# EAGLE design brobot19-MICRO (EAGLE 7.1.0)
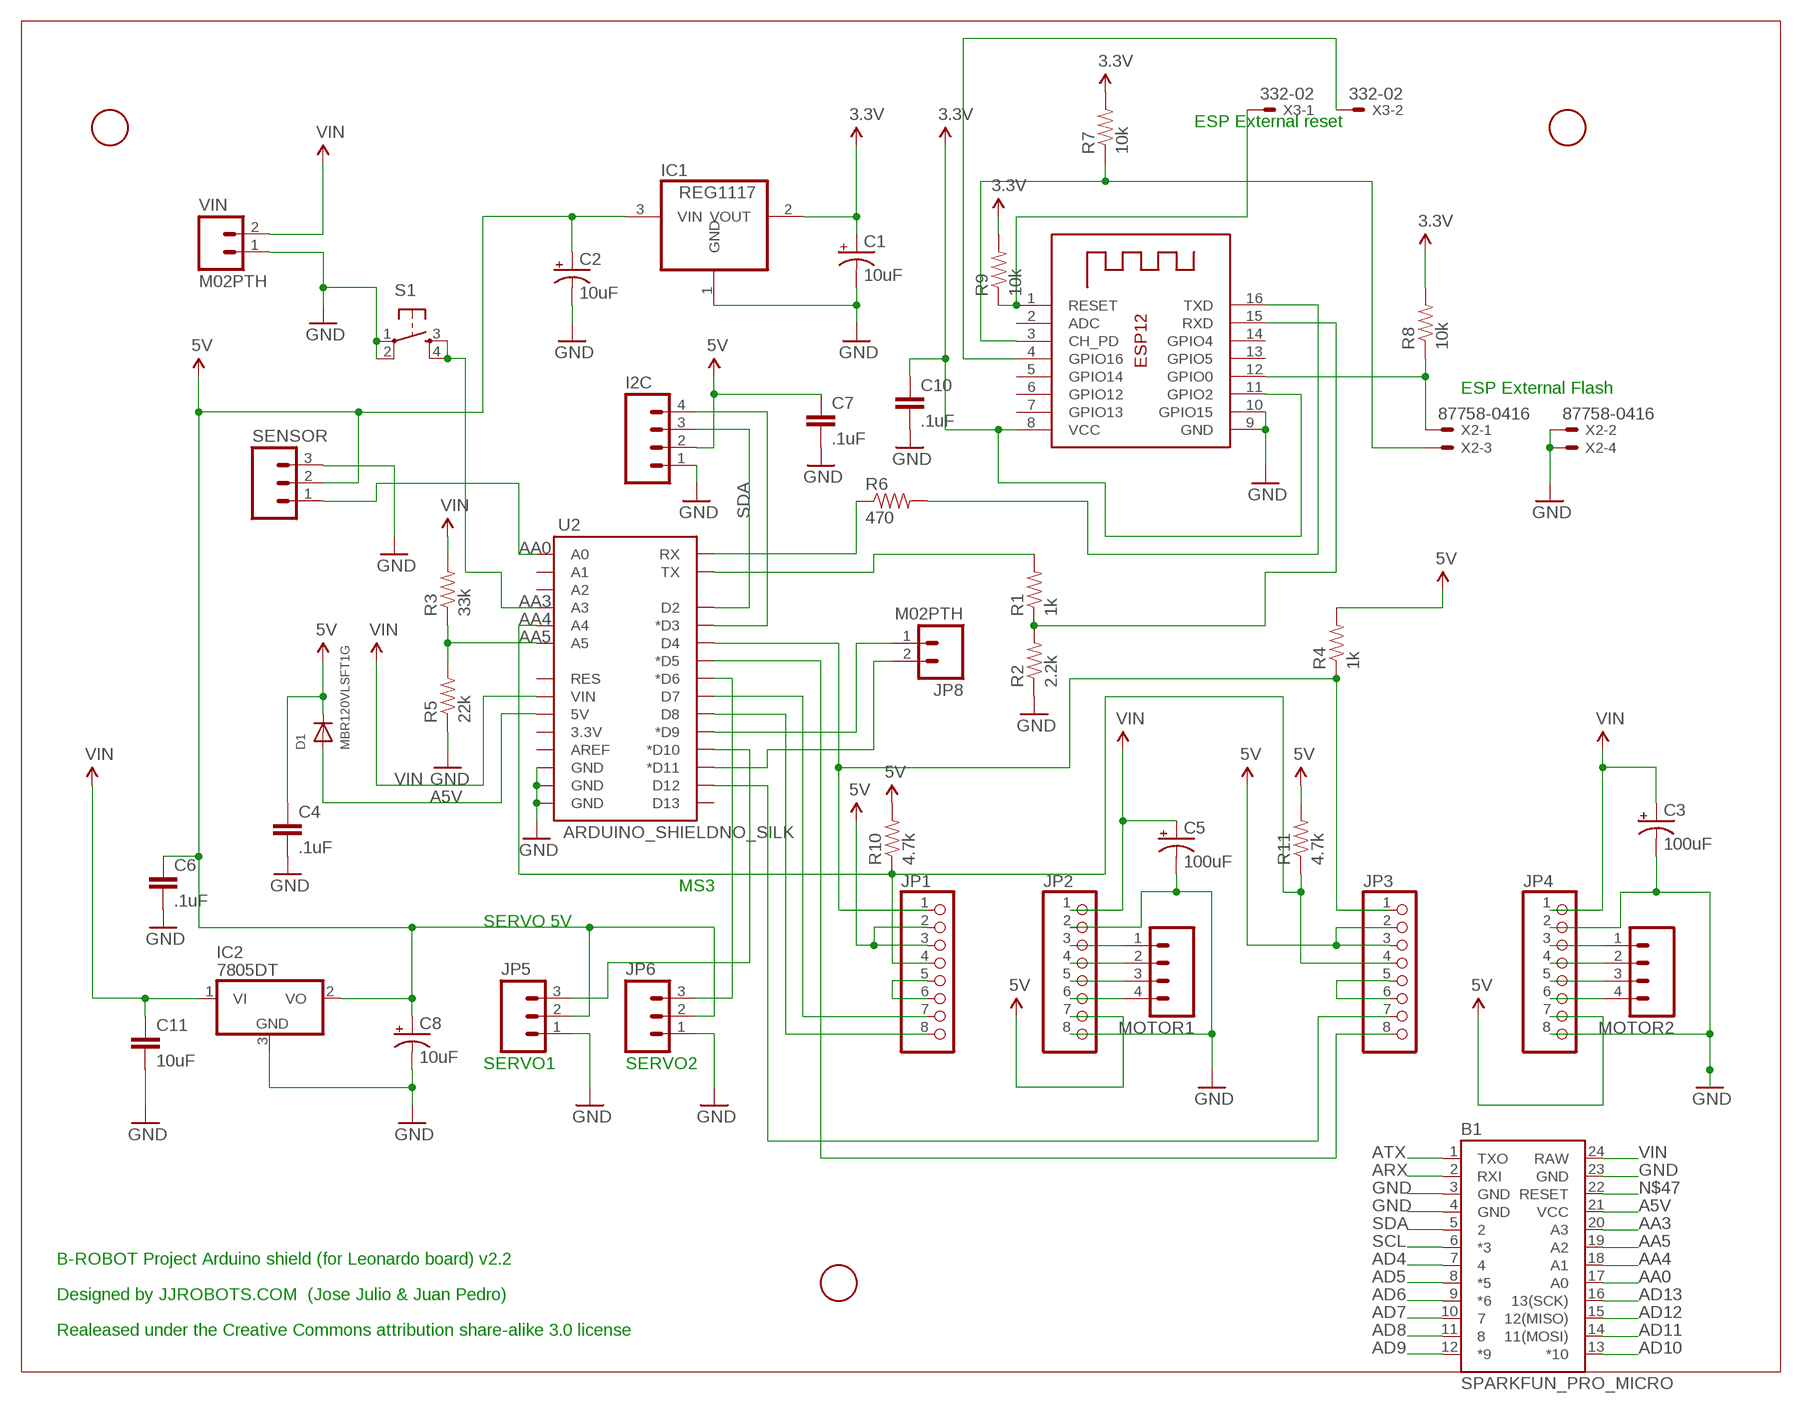
[diagram p0: schematic, sheet 1]

## Parts
B1  SPARKFUN_PRO_MICRO  [SPARKFUN_PRO_MICRO]
C1  10uF  CAP_POL1206  [EIA3216]
C2  10uF  CAP_POL1206  [EIA3216]
C3  100uF  CAP_POLD  [PANASONIC_D]
C4  .1uF  CAP0402-CAP  [0402-CAP]
C5  100uF  CAP_POLD  [PANASONIC_D]
C6  .1uF  CAP0402-CAP  [0402-CAP]
C7  .1uF  CAP0402-CAP  [0402-CAP]
C8  10uF  CAP_POL1206  [EIA3216]
C10  .1uF  CAP0402-CAP  [0402-CAP]
C11  10uF  CAP1206  [1206]
D1  MBR120VLSFT1G  DIODESOD-123  [SOD-123]
I2C  M04PTH  [1X04]
IC1  REG1117  [SOT223]
IC2  7805DT  [TO252]
JP1  PINHD-1X8  [1X08]
JP2  PINHD-1X8  [1X08]
JP3  PINHD-1X8  [1X08]
JP4  PINHD-1X8  [1X08]
JP5  M03PTH  [1X03]
JP6  M03PTH  [1X03]
JP8  M02PTH  [1X02]
MOTOR1  M04PTH  [1X04]
MOTOR2  M04PTH  [1X04]
R1  1k  RESISTOR0805-RES  [0805]
R2  2.2k  RESISTOR0805-RES  [0805]
R3  33k  RESISTOR0805-RES  [0805]
R4  1k  RESISTOR0805-RES  [0805]
R5  22k  RESISTOR0805-RES  [0805]
R6  470  RESISTOR0805-RES  [0805]
R7  10k  RESISTOR0805-RES  [0805]
R8  10k  RESISTOR0805-RES  [0805]
R9  10k  RESISTOR0805-RES  [0805]
R10  4.7k  RESISTOR0805-RES  [0805]
R11  4.7k  RESISTOR0805-RES  [0805]
S1  TAC_SWITCHSMD  [TACTILE-SWITCH-SMD]
SENSOR  M03PTH  [1X03]
U2  ARDUINO_SHIELDNO_SILK  [DUEMILANOVE_VIAS]
U$1  FIDUCIAL  [FIDUCIAL_1MM]
U$2  FIDUCIAL  [FIDUCIAL_1MM]
U$3  FIDUCIAL  [FIDUCIAL_1MM]
VIN  M02PTH  [1X02]
X1  ESP-12  [ESP-12]
X2  87758-0416  [87758-0416]
X3  332-02  [332-02]

## Nets
3.3V: C1.A(+) C10.1 IC1.2(VOUT) R7.2 R8.2 R9.2 X1.8(VCC) X1.11(GPIO2)
5V: C2.A(+) C4.1 C6.1 C7.1 C8.A(+) D1.C I2C.2 IC1.3(VIN) IC2.2(VO) JP1.2 JP1.3 JP2.7 JP3.2 JP3.3 JP4.7 JP5.2 JP6.2 R4.2 R10.2 R11.2 SENSOR.2
A5V: B1.21(VCC) D1.A U2.5V
AA0: B1.17(A0) SENSOR.1 U2.A0
AA3: B1.20(A3) S1.3 S1.4 U2.A3
AA4: B1.18(A1) JP1.4 JP3.4 R10.1 R11.1 U2.A4
AA5: B1.19(A2) R3.1 R5.2 U2.A5
AD4: B1.7 JP1.1 JP3.1 R4.1 U2.D4
AD5: B1.8(*5) JP3.8 U2.D5(*D5)
AD6: B1.9(*6) JP6.3 U2.D6(*D6)
AD7: B1.10 JP1.7 U2.D7
AD8: B1.11 JP1.8 U2.D8
AD9: B1.12(*9) JP8.1 U2.D9(*D9)
AD10: B1.13(*10) JP5.3 U2.D10(*D10)
AD11: B1.14(11(MOSI)) JP8.2 U2.D11(*D11)
AD12: B1.15(12(MISO)) JP3.7 U2.D12
AD13: B1.16(13(SCK))
ARX: B1.2(RXI) R6.1 U2.RX
ATX: B1.1(TXO) R1.2 U2.TX
GND: B1.3(GND) B1.4(GND) B1.23(GND) C1.C(-) C2.C(-) C3.- C4.2 C5.- C6.2 C7.2 C8.C(-) C10.2 C11.2 I2C.1 IC1.1(GND) IC2.3(GND) JP2.2 JP2.8 JP4.2 JP4.8 JP5.1 JP6.1 R2.1 R5.1 S1.1 S1.2 SENSOR.3 U2.GND@0(GND) U2.GND@1(GND) U2.GND@2(GND) VIN.1 X1.9(GND) X1.10(GPIO15) X2.2 X2.4
N$1: JP2.3 MOTOR1.1
N$2: JP2.4 MOTOR1.2
N$3: R6.2 X1.16(TXD)
N$4: R1.1 R2.2 X1.15(RXD)
N$6: JP2.5 MOTOR1.3
N$7: JP2.6 MOTOR1.4
N$8: JP4.3 MOTOR2.1
N$9: JP4.4 MOTOR2.2
N$10: JP4.5 MOTOR2.3
N$11: JP1.5 JP1.6
N$12: JP3.5 JP3.6
N$16: JP4.6 MOTOR2.4
N$18: R7.1 X1.3(CH_PD) X2.3
N$20: R8.1 X1.12(GPIO0) X2.1
N$29: R9.1 X1.1(RESET) X3.1
N$30: X1.4(GPIO16) X3.2
N$47: B1.22(RESET)
SCL: B1.6(*3) I2C.4 U2.D3(*D3)
SDA: B1.5 I2C.3 U2.D2
VIN: B1.24(RAW) C3.+ C5.+ C11.1 IC2.1(VI) JP2.1 JP4.1 R3.2 U2.VIN VIN.2
Unconnected: U2.3.3V U2.A1 U2.A2 U2.AREF U2.D13 U2.RES X1.2(ADC) X1.5(GPIO14) X1.6(GPIO12) X1.7(GPIO13) X1.13(GPIO5) X1.14(GPIO4)

## Notes on the sheet
- ESP External reset
- ESP External Flash
- MS3
- SERVO 5V
- SERVO1 | SERVO2
- B-ROBOT Project Arduino shield (for Leonardo board) v2.2
- Designed by JJROBOTS.COM  (Jose Julio & Juan Pedro)
- Realeased under the Creative Commons attribution share-alike 3.0 license

## Library data of the parts
B1 = SparkFun-Boards:SPARKFUN_PRO_MICRO: SparkFun Pro Micro Atmega32U4 compatible footprint. SparkFun Products: 3.3V/8MHz <https://www.sparkfun.com/products/12587> 5V/16MHz <https://www.sparkfun.com/products/12640>
C1-C3 C5 C8 = SparkFun-Passives:CAP_POL: Capacitor Polarized These are standard SMD and PTH capacitors. Normally 10uF, 47uF, and 100uF in electrolytic and tantalum varieties. Always verify the external diameter of the through hole cap, it varies with capacity, voltage, and manufacturer. The EIA devices should be standard.
C4 C6 C7 C10 C11 = SparkFun-Passives:CAP: Capacitor Standard 0603 ceramic capacitor, and 0.1" leaded capacitor.
D1 = adafruit:DIODE: Diode SMADIODE - SMA Surface Mount Package 20V 1A Schottky Diode Digikey: 641-1014-6-ND DO-1N4148 - Through Hole Small Current Diode SOD-123 20V 1 A (.5mV Vf) Schottky Diode - Digikey: MBRX120TPMSCT-ND SOD-323 10V 570mA (.38mV Vf, 3ns) Schottky Diode - Digikey: ZLLS410CT-ND SOD-523 30V 30mA Schottky Diode (RB751S-40TE61) - Digikey: RB751S-40TE61CT-ND SOT23-R/W - SOT23 Package (R = Solder Paste/Reflow Ovens, W = Hand-Soldering) BAT54Film 40V 300mA - Digikey: 497-7162-1-ND
I2C MOTOR1 MOTOR2 = SparkFun-Connectors:M04: Header 4 Standard 4-pin 0.1" header. Use with straight break away headers (SKU : PRT-00116), right angle break away headers (PRT-00553), swiss pins (PRT-00743), machine pins (PRT-00117), and female headers (PRT-00115). Molex polarized connector foot print use with SKU : PRT-08231 with associated crimp pins and housings. 1MM SMD Version SKU: PRT-10208
IC1 = burr-brown:REG1117: 800mA and 1A Low Dropout (LDO) Positive Regulator 1.8V, 2.5V, 2.85V, 3.3V, 5V, and Adj; MF: LM1117MPX-3.3/NOPB; MPN: REG1117; OC_FARNELL: 1097566; OC_NEWARK: 14P6981
IC2 = linear:78*: Positive VOLTAGE REGULATOR Source: http://cache.national.com/ds/LM/LM78L05.pdf http://www.fairchildsemi.com/ds/LM/LM7805.pdf
JP1-JP4 = pinhead:PINHD-1X8: PIN HEADER
JP5 JP6 SENSOR = SparkFun-Connectors:M03: Header 3 Standard 3-pin 0.1" header. Use with straight break away headers (SKU : PRT-00116), right angle break away headers (PRT-00553), swiss pins (PRT-00743), machine pins (PRT-00117), and female headers (PRT-00115). Molex polarized connector foot print use with SKU : PRT-08232 with associated crimp pins and housings.
JP8 VIN = SparkFun-Connectors:M02: Standard 2-pin 0.1" header. Use with - straight break away headers ( PRT-00116) - right angle break away headers (PRT-00553) - swiss pins (PRT-00743) - machine pins (PRT-00117) - female headers (PRT-00115) Molex polarized connector foot print use with: PRT-08233 with associated crimp pins and housings. 2.54_SCREWTERM for use with PRT-10571. 3.5mm Screw Terminal footprints for PRT-08084 5mm Screw Terminal footprints for use with PRT-08433
R1-R11 = SparkFun-Resistors:RESISTOR: Resistor Basic schematic elements and footprints for 0603, 1206, and PTH resistors.
S1 = SparkFun-Electromechanical:TAC_SWITCH: Momentary Switch Button commonly used for reset or general input. Spark Fun Electronics SKU : COM-00097 SMT- SWCH-08247
U2 = SparkFun-Boards:ARDUINO_SHIELD: Arduino shield footprint
U$1-U$3 = adafruit:FIDUCIAL: For use by pick and place machines to calibrate the vision/machine, 1mm By microbuilder.eu
X1 = adafruit:ESP-12
X2 = con-molex:87758-0416: 4 Pin - 2mm Dual Row Single Wafer, Vertical T/H HDR Source: http://www.molex.com/pdm_docs/sd/877580616_sd.pdf; MF: FARNELL; MPN: 87758-0416; OC_FARNELL: 7472315; OC_NEWARK: 39K3681
X3 = con-garry:332-02: 2 Pin - 2mm Dual Row Source: www.mpe-connector.de / garry_shortform_2012.pdf

## Board
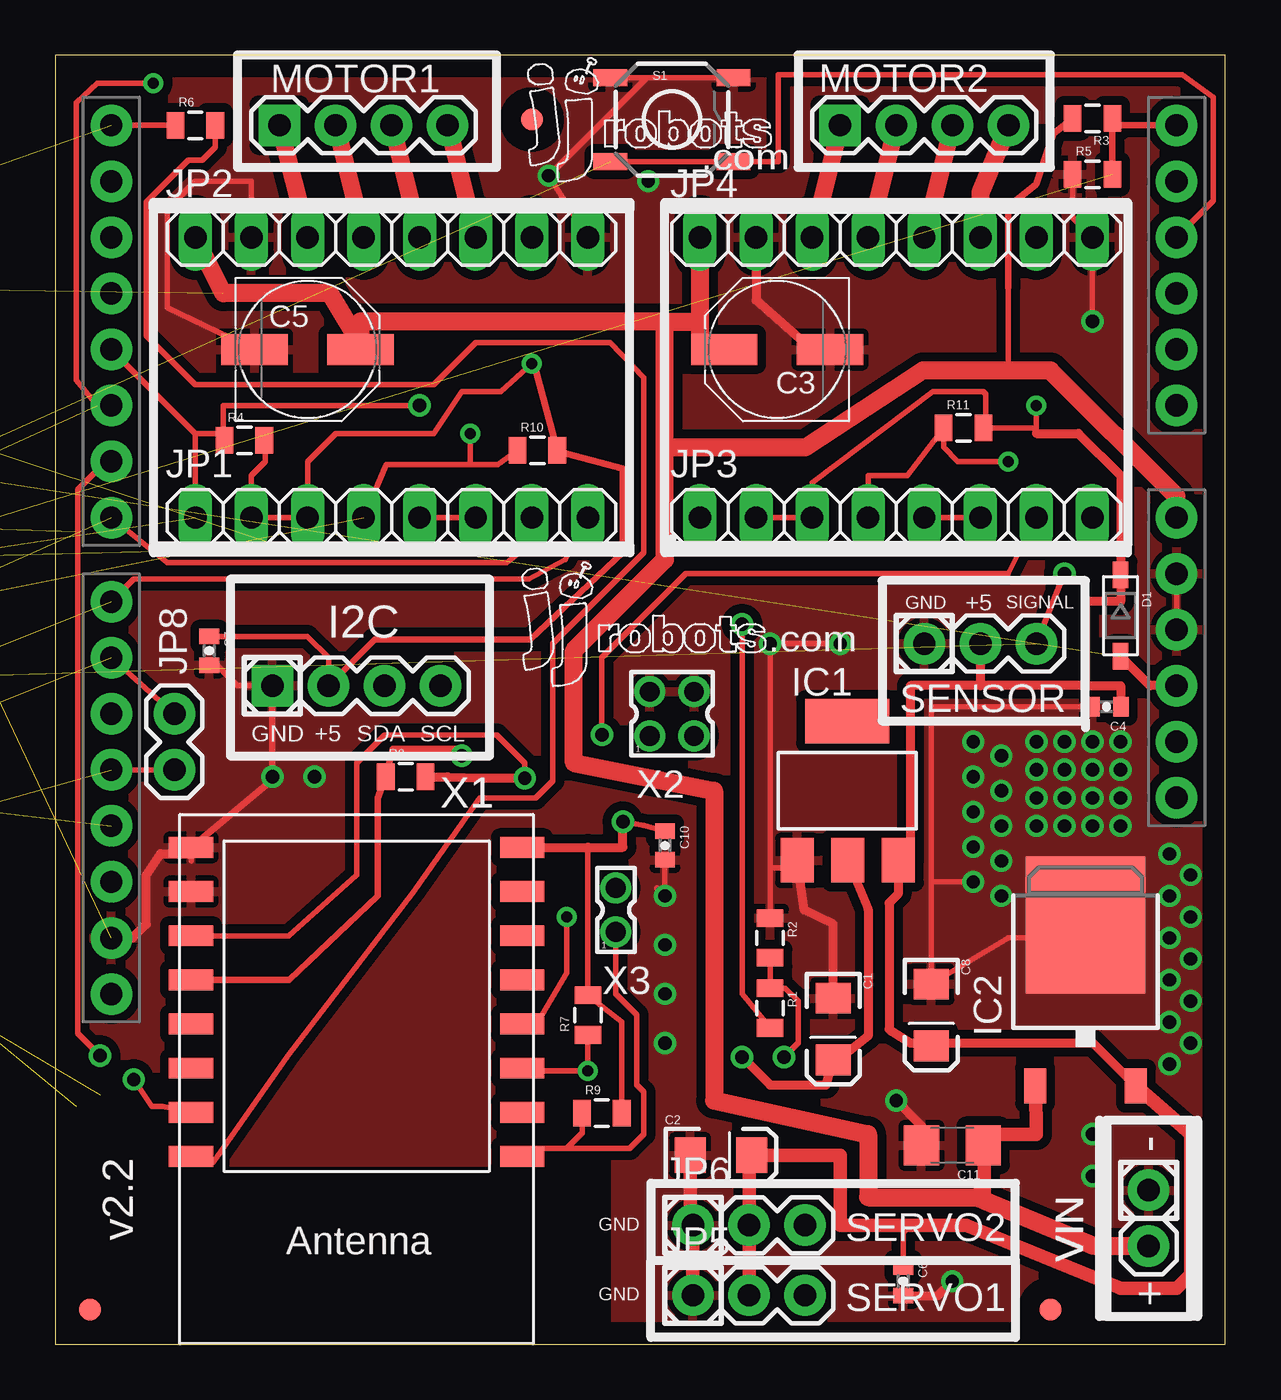
[diagram p1: board, top side]
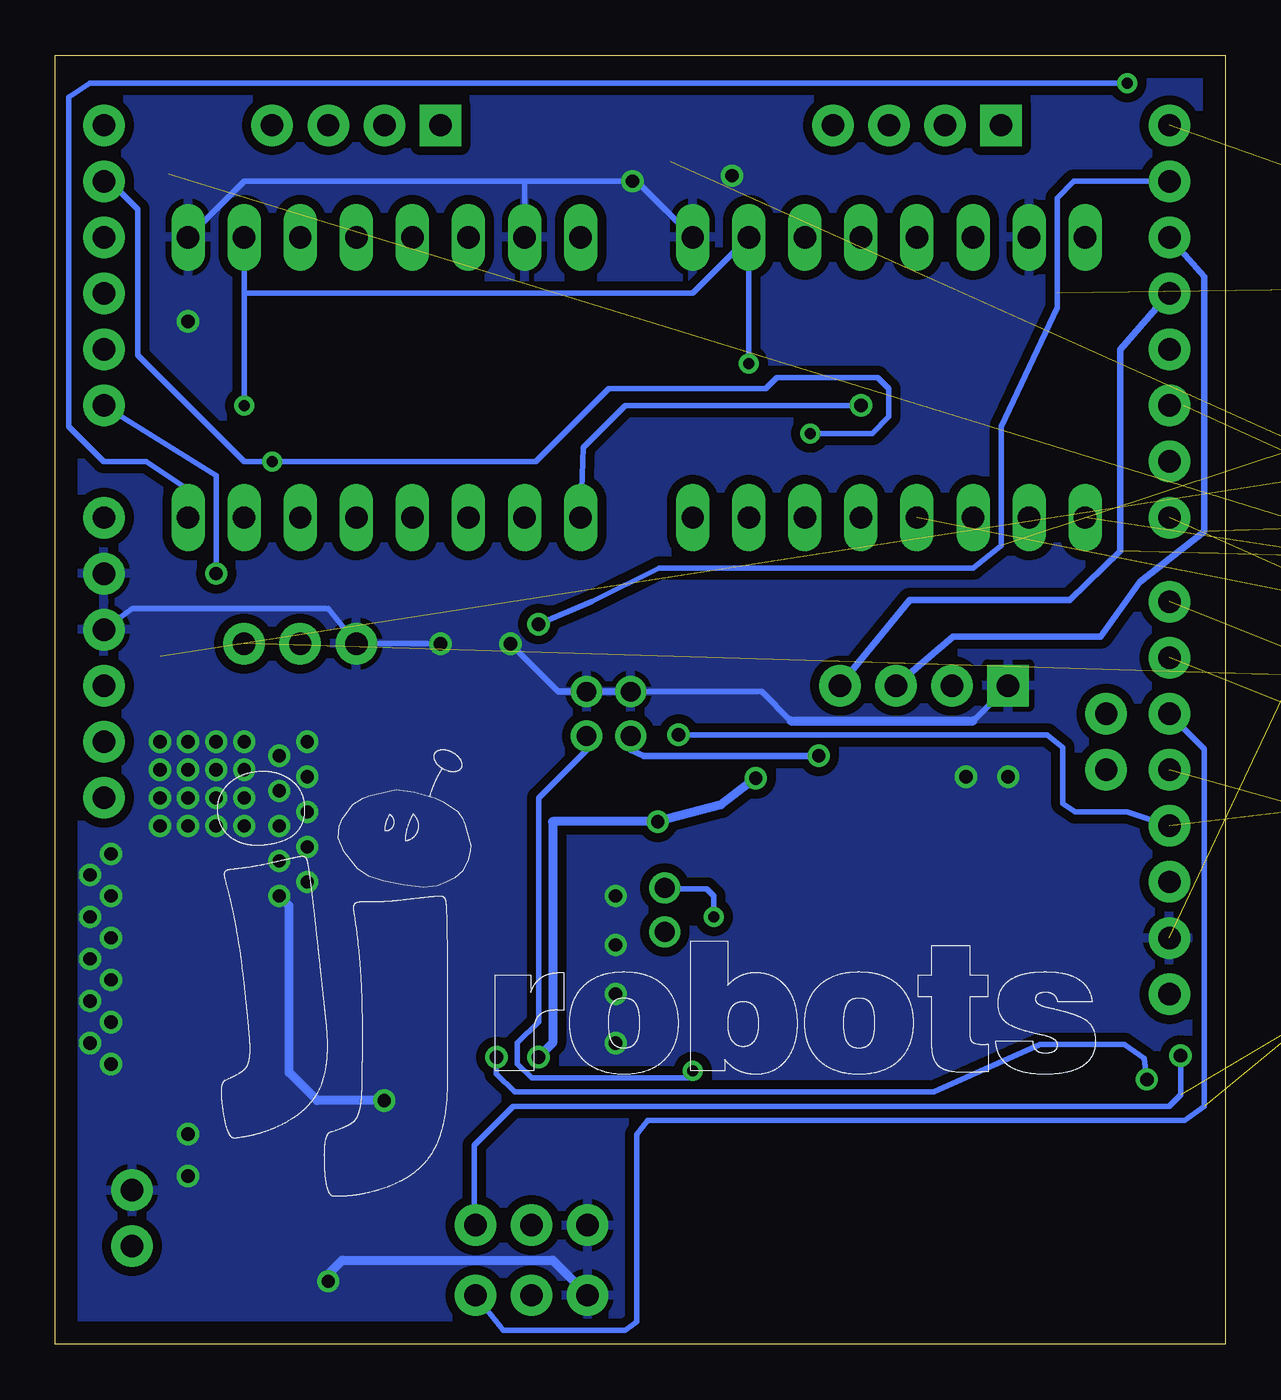
[diagram p2: board, bottom side, seen from below]

Size 53.01 x 58.42 mm. Coordinates in mm from the lower left corner, seen from the top.
Outline: 0,0 53.01,0 53.01,58.41 27.94,58.42 12.7,58.42 12.07,58.41 0,58.41 0,0
Copper layers (1*16): Top 0.035mm / dielectric 1.5mm / Bottom 0.035mm
Design rules "default": minimum track width 10mil, minimum drill 24mil, track to track 8mil, track to pad 8mil, pad to pad 8mil, via to via 8mil, smd to smd 8mil, copper to edge 40mil, drill to drill 8mil, minimum pad ring 10mil, minimum via ring 8mil, stop-mask expansion 4mil, vias tented up to drill 0mil, thermal gap 10mil

### Footprints (pad centres in the part's own frame; a part is rotated, then mirrored left to right if it is on the bottom)
SPARKFUN_PRO_MICRO = drill 1.016 pad 1.88: 1 -7.62,12.7; 2 -7.62,10.16; 3 -7.62,7.62; 4 -7.62,5.08; 5 -7.62,2.54; 6 -7.62,0; 7 -7.62,-2.54; 8 -7.62,-5.08; 9 -7.62,-7.62; 10 -7.62,-10.16; 11 -7.62,-12.7; 12 -7.62,-15.24; 13 7.62,-15.24; 14 7.62,-12.7; 15 7.62,-10.16; 16 7.62,-7.62; 17 7.62,-5.08; 18 7.62,-2.54; 19 7.62,0; 20 7.62,2.54; 21 7.62,5.08; 22 7.62,7.62; 23 7.62,10.16; 24 7.62,12.7
EIA3216 = smd 1.4 x 1.6: A 1.4,0; C -1.4,0
PANASONIC_D = smd 3 x 1.4: + 2.4,0; - -2.4,0
0402-CAP = smd 0.7 x 0.9: 1 -0.65,0; 2 0.65,0
1206 = smd 1.6 x 1.8: 1 -1.4,0; 2 1.4,0
SOD-123 = smd 1.2 x 0.7: A 1.85,0; C -1.85,0
1X04 = drill 1.016 pad 1.88 square: 1 0,0 | drill 1.016 pad 1.88: 2 2.54,0; 3 5.08,0; 4 7.62,0
SOT223 = smd 1.499 x 2.007: 1 -2.261,-3.15; 2 0.025,-3.15; 3 2.311,-3.15 | smd 3.81 x 2.007: 4 0,3.15
TO252 = smd 1 x 1.6: 1 -2.28,-4.8; 2 2.28,-4.8 | smd 5.4 x 6.2: 3 0,2.5
1X08 = drill 1.016 long: 1 -8.89,0; 2 -6.35,0; 3 -3.81,0; 4 -1.27,0; 5 1.27,0; 6 3.81,0; 7 6.35,0; 8 8.89,0
1X03 = drill 1.016 pad 1.88: 1 0,0; 2 2.54,0; 3 5.08,0
1X02 = drill 1.016 pad 1.88: 1 0,0; 2 2.54,0
0805 = smd 0.8 x 1.2: 1 -0.9,0; 2 0.9,0
TACTILE-SWITCH-SMD = smd 1.524 x 0.762: 1 -2.794,1.905; 2 2.794,1.905; 3 -2.794,-1.905; 4 2.794,-1.905
DUEMILANOVE_VIAS = drill 1.016 pad 1.88: 3.3V 50.8,13.97; 5V 50.8,16.51; A0 50.8,29.21; A1 50.8,31.75; A2 50.8,34.29; A3 50.8,36.83; A4 50.8,39.37; A5 50.8,41.91; AREF 2.54,2.54; D2 2.54,36.83; D3 2.54,34.29; D4 2.54,31.75; D5 2.54,29.21; D6 2.54,26.67; D7 2.54,24.13; D8 2.54,20.32; D9 2.54,17.78; D10 2.54,15.24; D11 2.54,12.7; D12 2.54,10.16; D13 2.54,7.62; GND@0 50.8,19.05; GND@1 50.8,21.59; GND@2 2.54,5.08; RES 50.8,11.43; RX 2.54,41.91; TX 2.54,39.37; VIN 50.8,24.13
FIDUCIAL_1MM = smd 1 x 1: 1 0,0
ESP-12 = smd 2 x 0.946: 1 -7.5,4.5; 2 -7.5,2.5; 3 -7.5,0.5; 4 -7.5,-1.5; 5 -7.5,-3.5; 6 -7.5,-5.5; 7 -7.5,-7.5; 8 -7.5,-9.5; 9 7.5,-9.5; 10 7.5,-7.5; 11 7.5,-5.5; 12 7.5,-3.5; 13 7.5,-1.5; 14 7.5,0.5; 15 7.5,2.5; 16 7.5,4.5
87758-0416 = drill 0.9 pad 1.27: 1 -1,-1; 2 -1,1; 3 1,-1; 4 1,1
332-02 = drill 0.9 pad 1.27: 1 0,-1; 2 0,1

### Placement (x,y rotation side)
B1  -17.78,35.18 0 top  (outside the outline)
C1  35.24,14.29 270 top
C2  30.16,8.57 0 top
C3  32.7,45.09 180 top
C4  47.62,28.89 180 top
C5  11.43,45.09 0 top
C6  38.42,2.86 270 top
C7  6.98,31.43 270 top
C8  39.69,14.92 270 top
C10  27.62,22.61 270 top
C11  40.64,9.02 180 top
D1  48.26,33.02 270 top
I2C  9.84,29.84 0 top
IC1  35.88,25.08 0 top
IC2  46.67,16.51 0 top
JP1  15.24,37.47 0 top
JP2  15.24,50.17 0 top
JP3  38.1,37.47 0 top
JP4  38.1,50.17 0 top
JP5  28.89,2.22 0 top
JP6  28.89,5.4 0 top
JP8  5.4,28.58 270 top
MOTOR1  10.16,55.25 0 top
MOTOR2  35.56,55.25 0 top
R1  32.39,15.24 270 top
R2  32.39,18.41 270 top
R3  46.99,55.56 180 top
R4  8.57,40.96 0 top
R5  46.99,53.02 0 top
R6  6.35,55.25 0 top
R7  24.13,14.92 90 top
R8  15.88,25.72 0 top
R9  24.77,10.48 0 top
R10  21.84,40.51 0 top
R11  41.15,41.53 0 top
S1  27.94,55.5 0 top
SENSOR  44.45,31.75 180 top
U2  0,13.34 0 top
U$1  1.59,1.59 0 top
U$2  21.59,55.5 0 top
U$3  45.09,1.59 0 top
VIN  49.53,6.98 270 top
X1  13.65,13.02 180 top
X2  27.94,28.58 0 top
X3  25.4,19.69 0 top

### Tracks (layer width: path | path; a pad name or v marks a point on that pad's centre or on a via)
3.3V  (via drill 0.6)
  Top 0.254: X1.11 10.58,18.52 13.65,21.27 13.65,26.35 14.92,27.62 20,27.62 21.27,26.35 v21.27,25.65 | 24.13,22.52 R7.2 25.67,14.61 R9.2 | C10.1 26.65,23.51 v25.72,23.69
  Top 0.406: IC1.2 36.83,19.71 36.83,13.97 35.24,12.7 C1.A 34.92,11.75 32.39,11.75 v31.11,13.02 | X1.8 24.13,22.52 25.72,22.52 v25.72,23.69 | R8.2 17.78,25.72 19.37,25.65 v21.27,25.65
  Bottom 0.406: v31.11,13.02 30.48,13.65 30.48,23.69 v25.72,23.69 22.86,24.45 v21.27,25.65
5V  (via drill 0.5)
  Top 0.254: R4.2 9.53,41.01 9.53,40.01 8.89,39.37 JP1.2 JP1.3 11.43,40.01 12.7,41.27 17.14,41.27 18.42,43.18 20.19,43.18 v21.59,44.45 | JP3.2 JP3.3 34.29,39.05 39.75,43.18 42.04,43.18 42.16,43.05 42.16,41.14 R11.2 44.45,41.53 | 44.45,41.53 v44.45,42.55 | C7.1 11.42,32.08 12.38,31.12 I2C.2 | C6.1 38.42,5.08 38.73,5.4 | 44.45,41.53 44.45,41.27
  Top 0.305: I2C.2 14.48,31.94 21.53,31.94 25.72,35.88 25.72,39.69 22.81,40.45 R10.2 21.73,44.31 v21.59,44.45
  Top 0.406: 44.45,41.27 46.36,41.27 48.26,39.37 D1.C 48.26,33.66 46.67,33.66 46.67,29.84 | 46.67,29.84 41.91,29.84 | 41.91,29.84 38.73,29.84 38.73,21.91 IC1.3 38.19,20.41 37.78,20 37.78,14.29 37.87,14.2 38.73,13.65 40.45,13.65 | 40.45,13.65 C8.A | 46.67,29.84 48.26,29.84 48.28,29.51 C4.1 | SENSOR.2 41.91,29.84 | 40.45,13.65 47.01,13.65 IC2.2
  Top 0.61: JP5.2 JP6.2 31.43,8.25 C2.A 35.56,8.57 35.56,5.4 38.73,5.4 41.28,5.4 48.26,2.54 50.8,2.54 51.44,3.18 51.44,9.55 IC2.2
  Bottom 0.254: 44.45,47.62 24.13,47.62 JP2.7 v21.59,44.45 | JP4.7 44.45,47.62 | 44.45,47.62 v44.45,42.55
A5V  (1 unrouted)
  Top 0.406: U2.5V 49.59,29.84 D1.A
AA0  (via drill 0.6)  (1 unrouted)
  Top 0.254: v45.72,34.92 SENSOR.1
  Bottom 0.254: U2.A0 45.72,39.37 v45.72,34.92
AA3  (1 unrouted)
  Top 0.254: S1.3 S1.4 32.77,53.59 32.77,57.53 51.05,57.53 52.45,56.52 52.45,51.82 U2.A3
AA4  (via drill 0.5)  (1 unrouted)
  Top 0.254: JP1.4 14.99,39.88 18.8,39.88 | R10.1 20.06,39.88 18.8,39.88 | JP3.4 36.83,39.37 38.6,39.37 R11.1 40.25,40.65 40.89,40.01 v43.18,40.01 | 18.8,39.88 v18.8,41.27
  Bottom 0.254: U2.A4 50.55,52.7 49.28,51.44 49.28,44.83 44.45,40.01 v43.18,40.01 31.24,40.01 27.94,43.31 20.83,43.31 20.32,43.81 15.75,43.81 15.24,43.31 15.24,42.04 16,41.27 v18.8,41.27
AA5  (1 unrouted)
  Top 0.305: U2.A5 48.26,55.25 47.94,55.56 R3.1 R5.2
AD4  (via drill 0.61)  (1 unrouted)
  Top 0.254: 6.35,41.27 7.62,41.27 | JP1.1 6.35,41.27 | v16.51,42.55 7.62,42.55 7.62,41.27 | 7.62,41.27 R4.1 | 6.35,41.27 U2.D4
  Bottom 0.254: JP3.1 29.08,40.64 27.18,42.55 v16.51,42.55
AD5  (via drill 0.5)  (1 unrouted)
  Top 0.254: v4.45,57.15 1.91,57.15 0.95,56.26 0.95,43.69 1.91,42.55 U2.D5
  Bottom 0.254: JP3.8 46.99,38.73 48.9,40.01 50.8,40.01 52.39,41.59 52.39,56.52 51.44,57.15 v4.45,57.15
AD6  (via drill 0.6)  (1 unrouted)
  Top 0.254: U2.D6 2.29,40.01 1.02,38.73 1.02,14.1 v2.03,13.08
  Bottom 0.254: v2.03,13.08 2.03,11.3 2.54,10.8 32.26,10.8 34.04,9.02 34.04,5.46 JP6.3
AD7  (1 unrouted)
  Top 0.254: JP1.7 21.59,36.32 20.45,35.43 5.08,35.43 U2.D7
AD8  (1 unrouted)
  Top 0.254: JP1.8 23.11,35.56 21.46,34.67 3.56,34.67 U2.D8
AD9  (1 unrouted)
  Top 0.254: U2.D9 JP8.1
AD10  (1 unrouted)
  Bottom 0.254: JP5.3 32.7,0.64 27.18,0.64 26.67,1.02 26.67,9.52 26.16,10.16 1.84,10.16 0.95,10.8 0.95,26.99 U2.D10
AD11  (1 unrouted)
  Top 0.254: U2.D11 JP8.2
AD12  (via drill 0.61)  (1 unrouted)
  Top 0.254: JP3.7 43.18,34.92 28.57,34.92 24.77,31.12 v24.77,27.62
  Bottom 0.254: v24.77,27.62 8.06,27.62 7.37,27.05 7.37,24.51 6.79,24.13 4.45,24.13 U2.D12
ARX  (1 unrouted)
  Top 0.254: U2.RX R6.1
ATX  (via drill 0.61)  (1 unrouted)
  Top 0.254: v31.11,32.64 31.11,15.88 R1.2
  Bottom 0.254: v31.11,32.64 28.7,33.66 25.65,35.18 11.43,35.18 10.16,36.2 10.16,41.59 7.62,46.99 7.62,51.94 6.86,52.7 U2.TX
GND  (via drill 0.6)  (3 unrouted)
  Top 0.254: 32.39,21.59 R2.1 | 32.39,21.59 33.66,21.59 IC1.1 | 32.39,21.59 v32.39,31.75 v35.56,31.75 | C4.2 39.69,28.91 39.69,20.95 | 39.69,20.95 C8.C 43.18,18.41 48.26,18.41 IC2.3 | C5.- 5.08,46.99 5.08,51.44 6.35,52.7 8.89,52.7 JP2.2 | 34.29,45.09 C3.- | R5.1 46.09,51.06 JP4.8 v46.99,46.35 | JP2.8 v22.35,52.96 26.8,57.4 S1.2 S1.1 | U2.GND@0 U2.GND@1 | 6.18,22.23 6.15,21.91 | 39.69,20.95 v41.59,20.95 | C7.2 7.32,30.78 8.25,29.84 I2C.1 | C10.2 v27.62,20.32 27.26,20.69
  Top 0.305: I2C.1 9.84,25.57 X1.9
  Top 0.406: C1.C 35.24,19.05 33.93,19.69 IC1.1 | 34.29,45.09 31.75,47.31 JP4.2 | U2.GND@2 3.49,18.41 4.13,19.05 4.13,21.27 4.76,22.23 6.18,22.23 X1.9 | C6.2 39.99,2.21 v40.64,2.86 | C11.2 39.24,9.91 v38.1,11.05
  Top 0.61: JP5.1 JP6.1 28.76,5.4 C2.C
  Bottom 0.254: JP4.8 44.45,52.7 31.75,52.7 | JP4.2 31.75,52.7 | JP2.8 26.67,52.7 31.75,52.7 | U2.GND@0 49.53,33.34 40.64,33.34 SENSOR.3 v35.56,31.75 | X2.2 21,29.58 19.68,28.26 | 11.43,28.26 I2C.1
  Bottom 0.305: v32.39,31.75 30.21,29.58 X2.4 X2.2
  Bottom 0.406: 19.68,28.26 11.43,28.26 | v40.64,2.86 40.64,3.18 40.01,3.81 30.48,3.81 JP5.1 | v38.1,11.05 41.15,11.05 42.42,12.32 42.42,19.88 v42.86,20.32
  other vias: 42.86,25.08 42.86,23.49 44.45,24.77 44.45,23.49 45.72,24.77 45.72,23.49 46.99,24.77 46.99,23.49 44.45,26.03 42.86,21.91 48.26,24.77 48.26,23.49 45.72,26.03 46.99,26.03 48.26,26.03 50.48,22.23 50.48,20.32 50.48,18.41 41.59,22.54 41.59,24.13 50.48,16.51 50.48,14.61 51.44,21.27 51.44,19.37 51.44,17.46 51.44,15.56 50.48,12.7 51.44,13.65 27.62,18.1 27.62,15.88 11.75,25.72 9.84,25.72 26.86,52.7 44.45,27.3 45.72,27.3 46.99,27.3 48.26,27.3 46.99,7.62 46.99,9.52 42.86,26.67 41.59,25.72 41.59,27.3 27.62,13.65
  pour Top (isolate 0.406): 0,58.42 53.34,58.42 53.34,-0.32 25.4,-0.32 25.4,8.25 0,8.25
  pour Bottom (isolate 0.406): 0,58.42 53.34,58.42 53.34,-0.32 25.4,-0.32 25.4,8.25 0,8.25
  pour Top (no thermals): 43.81,22.54 49.85,22.54 49.85,15.24 43.81,15.24
N$1
  Top 0.813: MOTOR1.1 JP2.3
N$2
  Top 0.813: MOTOR1.2 JP2.4
N$3
  Top 0.254: R6.2 7.25,54.24 6.67,53.66 6.03,53.66 4.13,51.75 4.13,45.72 6.35,43.5 17.14,43.5 19.05,45.4 25.15,45.4 26.67,43.81 26.67,35.88 22.54,31.75 22.54,25.53 21.78,24.77 19.24,24.77 16.19,20.45 10.54,13.08 7.16,8.25 X1.16
N$4  (via drill 0.6)
  Top 0.254: R2.2 R1.1 33.07,16.14 33.66,15.56 33.66,13.65 v33.02,13.02 | v3.56,12 4.38,10.8 4.84,10.8 X1.15
  Bottom 0.254: v33.02,13.02 33.02,12.26 32.2,11.43 13.21,11.43 8.38,13.59 4.57,13.59 3.68,12.95 v3.56,12
N$6
  Top 0.813: MOTOR1.3 JP2.5
N$7
  Top 0.813: MOTOR1.4 JP2.6
N$8
  Top 0.813: MOTOR2.1 JP4.3
N$9
  Top 0.813: MOTOR2.2 JP4.4
N$10
  Top 0.813: MOTOR2.3 JP4.5
N$11
  Top 0.254: JP1.6 JP1.5
N$12
  Top 0.254: JP3.6 JP3.5
N$16
  Top 0.813: MOTOR2.4 41.91,52.2 JP4.6
N$18  (via drill 0.5)
  Top 0.254: X1.3 21.29,12.38 v24.13,12.38 R7.1
  Bottom 0.254: X2.3 28.94,26.94 31.11,24.77 31.11,14.61 32.07,13.65 32.07,12.7 31.43,12.07 24.13,12.07 v24.13,12.38
N$20  (via drill 0.6)
  Top 0.305: X1.12 10.6,16.51 14.61,20.32 14.61,24.77 R8.1 15.29,26.99 18.1,26.99 v18.42,26.67
  Bottom 0.305: X2.1 26.94,26.94 26.35,26.67 v18.42,26.67
N$29
  Top 0.254: R9.1 23.86,9.58 23.18,8.89 | 23.18,8.89 21.53,8.89 X1.1 | X3.1 25.4,15.88 26.35,14.92 26.35,11.75 26.67,11.43 26.67,9.52 26.04,8.89 23.18,8.89
N$30  (via drill 0.5)
  Top 0.254: X1.4 21.82,14.52 23.18,16.83 v23.18,19.37
  Bottom 0.254: v23.18,19.37 23.18,20.32 23.5,20.64 25.35,20.64 X3.2
SCL  (1 unrouted)
  Bottom 0.305: I2C.4 14.29,33.72 7.05,33.72 4.76,35.94 4.76,45.09 U2.D3
SDA  (1 unrouted)
  Bottom 0.305: I2C.3 12.32,32.07 5.65,32.07 3.87,34.54 0.95,36.83 0.95,48.39 U2.D2
VIN  (1 unrouted)
  Top 0.254: 43.18,47.88 43.18,44.13
  Top 0.305: R3.2 45.72,55.25 45.21,54.86 44.45,52.58 43.18,51.56 43.18,47.88
  Top 0.61: 44.45,10.22 44.45,10.16 | 44.45,10.16 44.39,11.75 | 27.94,40.64 27.62,40.96 | C11.1 42.08,9.52 | 42.08,9.52 42.08,6.52 | 42.08,9.52 44.45,9.52 44.45,10.16
  Top 0.813: 27.62,46.35 27.62,40.96 27.62,35.56 23.5,31.43 23.5,26.35 29.85,25.08 29.85,11.05 36.83,9.52 36.83,6.67 41.72,6.67 42.08,6.52 47.12,4.45 VIN.2 | C3.+ 29.21,45.09 29.21,46.35 | 29.21,46.35 JP4.1 | 27.62,46.35 29.21,46.35 | 27.62,46.35 13.83,46.35 C5.+ 13.97,45.09 12.45,47.62 7.62,47.62 JP2.1 | 44.39,11.75 IC2.1 | U2.VIN 50.8,38.42 45.09,44.13 43.18,44.13 39.31,44.13 33.97,40.64 27.94,40.64

### Text on the board
tNames: .com | GND | +5 | SIGNAL | .com | GND | +5 | SDA | SCL | - | v2.2 | VIN | GND | SERVO2 | + | GND | SERVO1
tSilk: BRobot | BRobot
_tsilk: BRobot v1.0
_bsilk: JJROBOTS.com | BRobot v1.0
_tNames: MOTOR1 | MOTOR2 | SJ1 | SJ2 | C5 | C3 | I2C | SENSOR | JMP | C4 | - | +
201bmp: G:/Users/Juan Pedro/Desktop/jJrobots/logotipo JJROBOTS negro minusculo 7 mm.bmp